# EAGLE schematic clink (EAGLE 6.5.0)
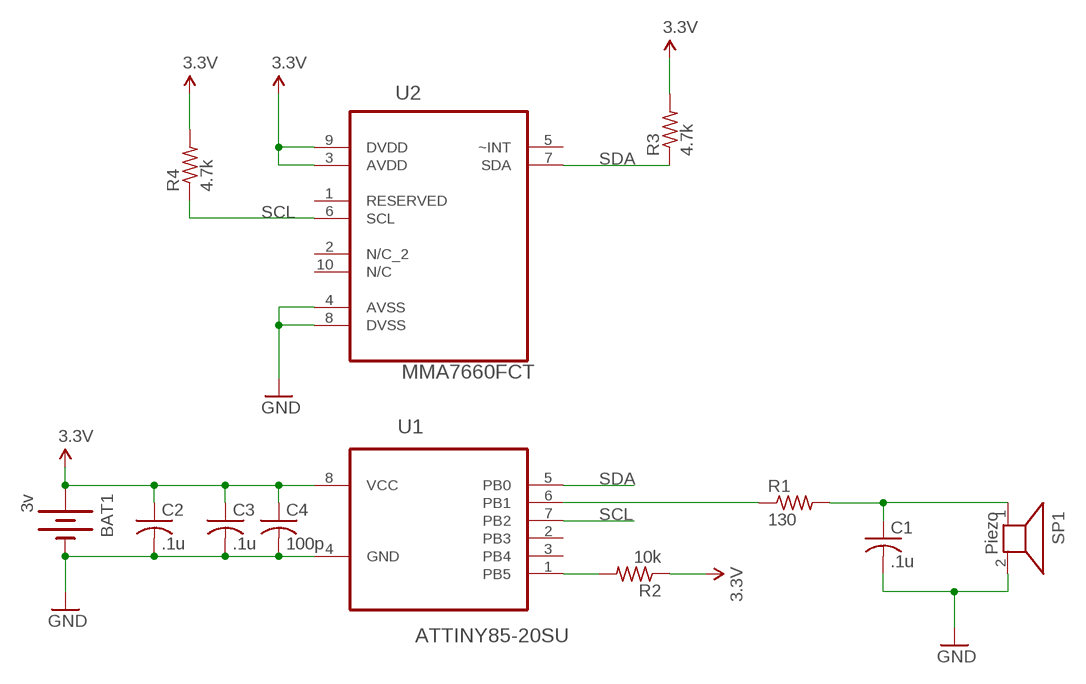
[diagram p0: schematic, sheet 1]

## Parts
BAT1  3v  BATTERY20SMD  [BATTCON_20MM]
C1  .1u  C-USC0603  [C0603]
C2  .1u  C-USC0603  [C0603]
C3  .1u  C-USC0603  [C0603]
C4  100p  C-USC0603  [C0603]
R1  130  R-US_R0603  [R0603]
R2  10k  R-US_R0603  [R0603]
R3  4.7k  R-US_R0603  [R0603]
R4  4.7k  R-US_R0603  [R0603]
SP1  Piezo  AL201P  [AL201P]
U1  ATTINY85-20SU  [SOIC127P798X216-8N]
U2  MMA7660FCT  [DFN300X300X100-10N]

## Nets
3.3V: BAT1.1(+) C2.1 C3.1 C4.1 R2.1 R3.2 R4.2 U1.8(VCC) U2.3(AVDD) U2.9(DVDD)
GND: BAT1.2(-) C1.2 C2.2 C3.2 C4.2 SP1.2 U1.4(GND) U2.4(AVSS) U2.8(DVSS)
N$1: C1.1 R1.2 SP1.1
N$3: R1.1 U1.6(PB1)
N$9: R2.2 U1.1(PB5)
SCL: R4.1 U1.7(PB2) U2.6(SCL)
SDA: R3.1 U1.5(PB0) U2.7(SDA)
Unconnected: U1.2(PB3) U1.3(PB4) U2.1(RESERVED) U2.2(N/C_2) U2.5(~INT) U2.10(N/C)

## Library data of the parts
BAT1 = SparkFun-Electromechanical:BATTERY: Battery Holders Various common sizes : AA, AAA, 20mm coin cell and 12mm coin cell. 20MM_4LEGS, BATT-10373
C1-C4 = rcl:C-US: CAPACITOR, American symbol
R1-R4 = rcl:R-US_: RESISTOR, American symbol
SP1 = buzzer:AL201P: SPEAKER Source: Buerklin; OC_FARNELL: unknown; OC_NEWARK: unknown
U1 = Atmel_By_element14_Batch_1-00:ATTINY85-20SU: 8-bit Microcontroller with In-System Programmable Flash; MPN: ATTINY85-20SU; OC_FARNELL: 1455164; OC_NEWARK: 58M3797; PACKAGE: SOIC-8; SUPPLIER: Atmel
U2 = Freescale_By_element14_Batch_1:MMA7660FCT: Detection Sensor; MPN: MMA7660FCT; OC_FARNELL: -; OC_NEWARK: 74P0443; PACKAGE: DFN-10; SUPPLIER: FREESCALE SEMICONDUCTOR